# Altium project AVCI_Mk1.PrjPcb (part 2 of 3)

## Sheet NAVC_Peripherals.SchDoc
size A4; SheetNumber: 3; SheetTotal: 8
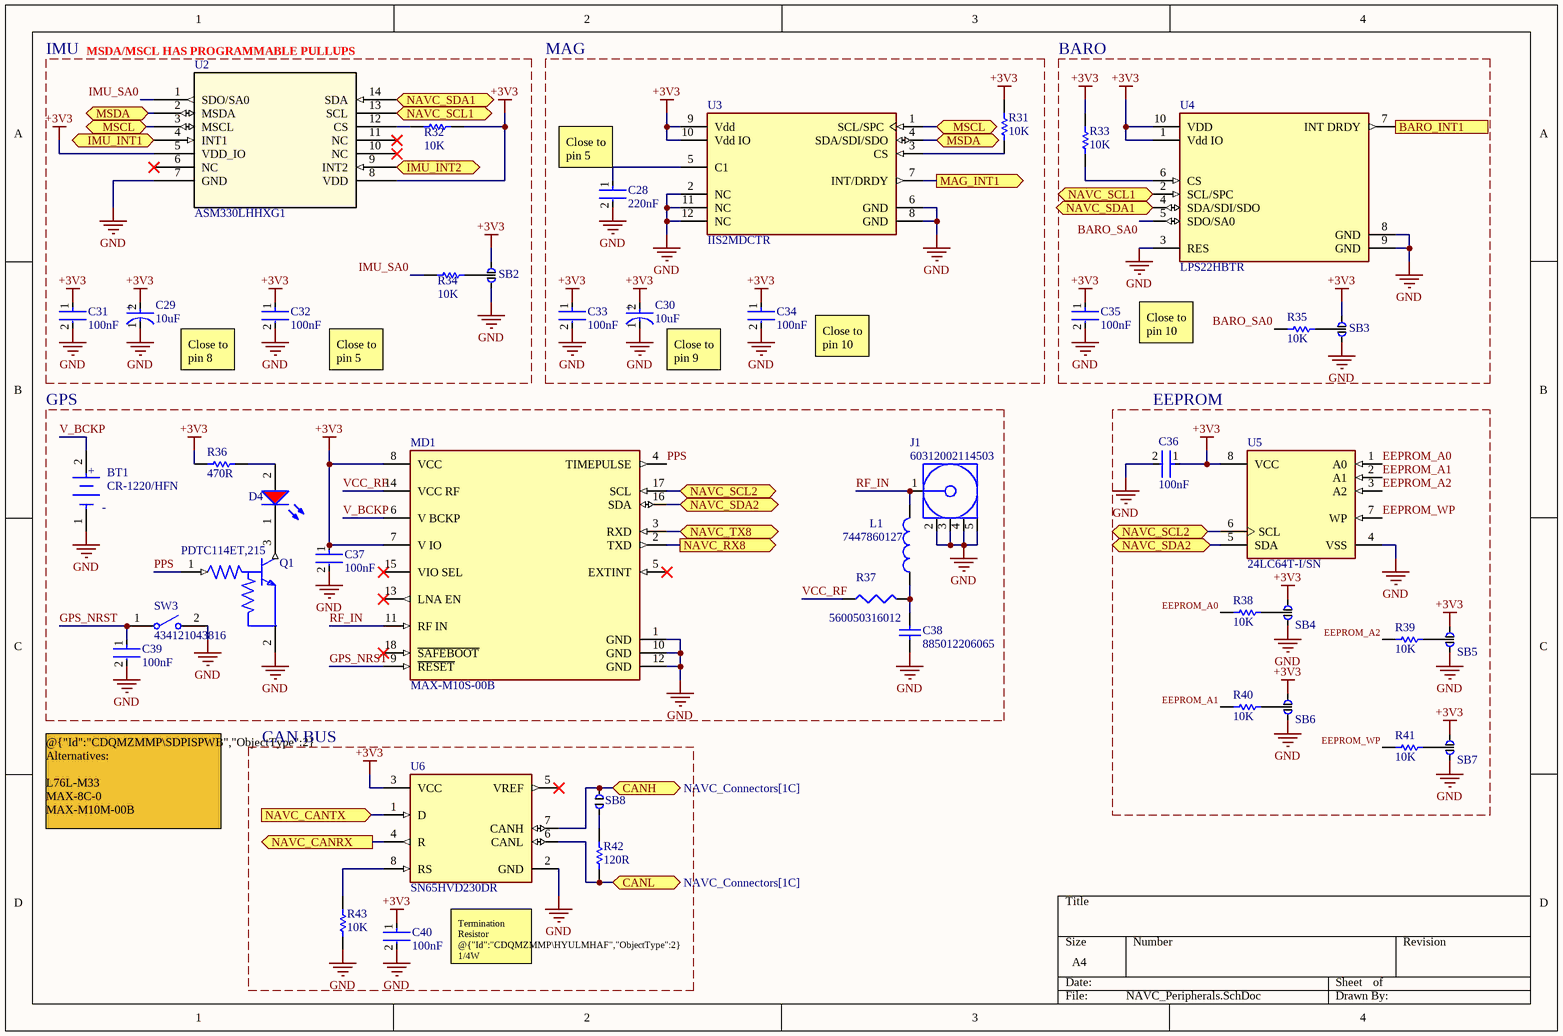
[diagram p4: NAVC_Peripherals.SchDoc]

### Parts
BT1  CR-1220/HFN  [FP-CR-1220-HFN-MFG]
C28  220nF  [FP-C0603C-CF-MFG]
C29  10uF  [FP-T491A106K006AT-MFG]
C30  10uF  [FP-T491A106K006AT-MFG]
C31  100nF  [FP-CGA3E-0_3-0_1-IPC_A]
C32  100nF  [FP-CGA3E-0_3-0_1-IPC_A]
C33  100nF  [FP-CGA3E-0_3-0_1-IPC_A]
C34  100nF  [FP-CGA3E-0_3-0_1-IPC_A]
C35  100nF  [FP-CGA3E-0_3-0_1-IPC_A]
C36  100nF  [FP-CGA3E-0_3-0_1-IPC_A]
C37  100nF  [FP-CGA3E-0_3-0_1-IPC_A]
C38  885012206065  [WCAP-CSGP_0603_L1.6W0.8H0.8_Reflow]
C39  100nF  [FP-CGA3E-0_3-0_1-IPC_A]
C40  100nF  [FP-CGA3E-0_3-0_1-IPC_A]
D4  150120SS75000  [WL-SMCW_1206_150120xx75000]  (value not drawn)
J1  60312002114503  [60312002114503]
L1  7447860127  [WE-MK_0603_L1.6W0.8H0.8]
MD1  MAX-M10S-00B  [FP-MAX-M10S-00B-MFG]
Q1  PDTC114ET,215  [FP-SOT23-MFG]
R31  10K  [RESC1609X50X30NL8T20]
R32  10K  [RESC1609X50X30NL8T20]
R33  10K  [RESC1609X50X30NL8T20]
R34  10K  [RESC1609X50X30NL8T20]
R35  10K  [RESC1609X50X30NL8T20]
R36  470R  [RESC1609X50X30NL8T20]
R37  560050316012  [WRIS-KSKE_0603_L1.6W0.8H0.45]
R38  10K  [RESC1608X55X25ML10T15]
R39  10K  [RESC1608X55X25ML10T15]
R40  10K  [RESC1608X55X25ML10T15]
R41  10K  [RESC1608X55X25ML10T15]
R42  120R  [RESC1608X55X25ML10T15]
R43  10K  [RESC1608X55X25ML10T15]
SB2  Solderbridge3P  [SolderBridge3P]  (value not drawn)
SB3  Solderbridge3P  [SolderBridge3P]  (value not drawn)
SB4  Solderbridge3P  [SolderBridge3P]  (value not drawn)
SB5  Solderbridge3P  [SolderBridge3P]  (value not drawn)
SB6  Solderbridge3P  [SolderBridge3P]  (value not drawn)
SB7  Solderbridge3P  [SolderBridge3P]  (value not drawn)
SB8  SolderbridgeOpen  [SolderBridgeOpen]  (value not drawn)
SW3  434121043816  [434121043816]
U2  ASM330LHHXG1  [LGA-14L_STM]
U3  IIS2MDCTR  [FP-LGA-12-DM00170568-MFG]
U4  LPS22HBTR  [FP-HLGA-10L-8479831-0]
U5  24LC64T-I/SN  [FP-C04-057-SN-MFG]
U6  SN65HVD230DR  [FP-D0008A-IPC_A]

### Blocks framed on the sheet
IMU: C29 C31 C32 R32 R34 SB2 U2
MAG: C28 C30 C33 C34 R31 U3
BARO: C35 R33 R35 SB3 U4
GPS: BT1 C37-C39 D4 J1 L1 MD1 Q1 R36 R37 SW3
EEPROM: C36 R38-R41 SB4-SB7 U5
CAN BUS: C40 R42 R43 SB8 U6

### Ports
BARO_INT1 (out, see NAVC_MCU[2A]), CANH (bidir, see NAVC_Connectors[1C]), CANL (bidir, see NAVC_Connectors[1C]), IMU_INT1 (bidir, see NAVC_MCU[2A]), IMU_INT2 (bidir, see NAVC_MCU[2A]), MAG_INT1 (out, see NAVC_MCU[2A]), MSCL (bidir, see NAVC_Peripherals[1A]), MSCL (bidir, see NAVC_Peripherals[3A]), MSDA (bidir, see NAVC_Peripherals[1A]), MSDA (bidir, see NAVC_Peripherals[3A]), NAVC_CANRX (out, see NAVC_MCU[1A]), NAVC_CANTX (in, see NAVC_MCU[1B]), NAVC_RX8 (out, see NAVC_MCU[1C], NAVC_MCU[2D]), NAVC_SCL1 (bidir, see NAVC_MCU[2A], NAVC_MCU[2D], NAVC_Peripherals[2A]), NAVC_SCL1 (bidir, see NAVC_MCU[2A], NAVC_MCU[2D], NAVC_Peripherals[3A]), NAVC_SCL2 (bidir, see NAVC_MCU[2C], NAVC_MCU[2D], NAVC_Peripherals[2B]), NAVC_SCL2 (bidir, see NAVC_MCU[2C], NAVC_MCU[2D], NAVC_Peripherals[3C]), NAVC_SDA1 (bidir, see NAVC_MCU[2A], NAVC_MCU[2D], NAVC_Peripherals[2A]), NAVC_SDA1 (bidir, see NAVC_MCU[2A], NAVC_MCU[2D], NAVC_Peripherals[3A]), NAVC_SDA2 (bidir, see NAVC_MCU[2C], NAVC_MCU[2D], NAVC_Peripherals[2B]), NAVC_SDA2 (bidir, see NAVC_MCU[2C], NAVC_MCU[2D], NAVC_Peripherals[3C]), NAVC_TX8 (bidir, see NAVC_MCU[1C], NAVC_MCU[2D])

### Nets
+3V3: C29.2(A) C30.2(A) C31.1 C32.1 C33.1 C34.1 C35.1 C36.1 C37.1 C40.1 MD1.7(V_IO) MD1.8(VCC) R31.2 R32.1 R33.2 R36.2 SB2.1 SB3.1 SB4.1 SB5.1 SB6.1 SB7.1 U2.5(VDD_IO) U2.8(VDD) U3.9(Vdd) U3.10(Vdd_IO) U4.1(Vdd_IO) U4.10(VDD) U5.8(VCC) U6.3(VCC)
GND: BT1.1(C) C28.2 C29.1(C) C30.1(C) C31.2 C32.2 C33.2 C34.2 C35.2 C36.2 C37.2 C38.1 C39.2 C40.2 J1.2(GND) J1.3(GND) J1.4(GND) J1.5(GND) MD1.1(GND) MD1.10(GND) MD1.12(GND) Q1.2(GND) R43.2 SB2.2 SB3.2 SB4.2 SB5.2 SB6.2 SB7.2 SW3.2 U2.7(GND) U3.2(NC) U3.6(GND) U3.8(GND) U3.11(NC) U3.12(NC) U4.3(RES) U4.8(GND) U4.9(GND) U5.4(VSS) U6.2(GND)
BARO_SA0: R35.2 U4.5(SDO/SA0)
EEPROM_A0: R38.2 U5.1(A0)
EEPROM_A1: R40.2 U5.2(A1)
EEPROM_A2: R39.2 U5.3(A2)
EEPROM_WP: R41.2 U5.7(WP)
GPS_NRST: C39.1 MD1.9(~{RESET}) SW3.1
IMU_SA0: R34.2 U2.1(SDO/SA0)
PPS: MD1.4(TIMEPULSE) Q1.1(I)
RF_IN: J1.1(Signal) L1.2 MD1.11(RF_IN)
V_BCKP: BT1.2(A) MD1.6(V_BCKP)
VCC_RF: MD1.14(VCC_RF) R37.1
NetC28_1: C28.1 U3.5(C1)
NetC38_2: C38.2 L1.1 R37.2
NetD4_1: D4.1(K) Q1.3(O)
NetD4_2: D4.2(A) R36.1
NetMD1_2: MD1.2(TXD) ; port NAVC_RX8
NetMD1_3: MD1.3(RXD) ; port NAVC_TX8
NetMD1_16: MD1.16(SDA) U5.5(SDA) ; port NAVC_SDA2
NetMD1_17: MD1.17(SCL) U5.6(SCL) ; port NAVC_SCL2
NetP6_2: R42.2 U6.6(CANL) ; port CANL
NetP6_3: SB8.2 U6.7(CANH) ; port CANH
NetR1_5: U3.7(INT/DRDY) ; port MAG_INT1
NetR1_6: U2.4(INT1) ; port IMU_INT1
NetR1_7: U2.9(INT2) ; port IMU_INT2
NetR1_8: U4.7(INT_DRDY) ; port BARO_INT1
NetR9_1: U6.4(R) ; port NAVC_CANRX
NetR10_1: U6.1(D) ; port NAVC_CANTX
NetR24_1: U2.13(SCL) U4.2(SCL/SPC) ; port NAVC_SCL1
NetR25_1: U2.14(SDA) U4.4(SDA/SDI/SDO) ; port NAVC_SDA1
NetR31_1: R31.1 U3.3(CS)
NetR32_2: R32.2 U2.12(CS)
NetR33_1: R33.1 U4.6(CS)
NetR34_1: R34.1 SB2.3
NetR35_1: R35.1 SB3.3
NetR38_1: R38.1 SB4.3
NetR39_1: R39.1 SB5.3
NetR40_1: R40.1 SB6.3
NetR41_1: R41.1 SB7.3
NetR42_1: R42.1 SB8.1
NetR43_1: R43.1 U6.8(RS)
NetU2_2: U2.2(MSDA) U3.4(SDA/SDI/SDO) ; port MSDA
NetU2_3: U2.3(MSCL) U3.1(SCL/SPC) ; port MSCL

Not connected (* = marked no-connect by the designer): MD1 5(EXTINT)* 13(LNA_EN)* 15(VIO_SEL)* 18(~{SAFEBOOT})*; U2 6(NC)* 10(NC)* 11(NC)*; U6 5(VREF)*

### Notes on the sheet
- (near U2) MSDA/MSCL HAS PROGRAMMABLE PULLUPS
- (near C28) Close to pin 5
- Close to pin 8
- Close to pin 5
- Close to pin 9
- Close to pin 10
- @{"Id":"CDQMZMMP\SDPISPWB","ObjectType":2} Alternatives:
  L76L-M33
  MAX-8C-0
  MAX-M10M-00B
- Termination Resistor @{"Id":"CDQMZMMP\HYULMHAF","ObjectType":2} 1/4W
- (in symbol CMP-03017-000032-1) +
- (in symbol CMP-05417-000010-1) +; -

### Library data of the parts
BT1 = CMP-05417-000010-1: BATTERY LITHIUM 3V COIN 12.5MM; Manufacturer: Panasonic; Standoff Height: 2.9mm; Temperature Range High: +60°C; Temperature: -30°C to +60°C; Device Class L2: unset; Height: 5.5mm; Category: Batt; Device Class L3: unset; Package: CR-1220/HFN; ComponentLink2URL: https://industrial.panasonic.com/cdbs/www-data/pdf2/AAA4000/AAA4000D138.PDF; ComponentLink2Description: Datasheet; Temperature Range Low: -30°C; Mouser Description: CR1220 Series Ø 12.5 mm 3 V 35 mAh Non-Rechargeable Lithium Coin Cell Battery; Octopart: https://octopart.com/cr-1220%2Fhfn-panasonic-13183313; Manufacturer Part Number: CR-1220/HFN; Automotive: No; Digikey Description: BATTERY LITHIUM 3V COIN 12.5MM; Device Class L1: Passive Components
C28 = CMP-2006-03146-2: CAP CER 0.22UF 25V 10% X7R 0603; Manufacturer: KEMET; Manufacturer Part Number: C0603C224K3RACTU; Temperature Coefficient: 30ppm/°C; Value: 0.22 μF; Material: Ceramic; Tolerance: 0.1; Automotive Grade: Grade 1; Device Class L2: Capacitors; Automotive: Yes; RoHS: TRUE; Digikey Description: CAP CER 0.22UF 25V 10% X7R 0603; Package: C0603C-CF; Height: 0.87mm; Temperature Characteristic: X7R; Mouser Description: Multilayer Ceramic Capacitors MLCC - SMD/SMT 25volts 0.22uF X7R 10%; Device Class L3: Ceramic Capacitors; Lead Free: Yes; Capacitance: 0.22 μF; Device Class L1: Passive Components; ComponentLink2Description: Datasheet; Temperature: -55°C to +125°C; Voltage Rating: 25 V; Temperature Range Low: -55°C; ComponentLink2URL: https://api.kemet.com/component-edge/download/datasheet/C0603C100J5GACAUTO.pdf; Octopart: https://octopart.com/c0603c224k3ractu-kemet-129141; Temperature Range High: +125°C; Category: Cap
C29 C30 = CMP-03017-000032-1: CAP TANT 10UF 10% 6.3V 1206; Life (Hours): 2000Hour; Polarity: Polar; Dielectric Material: Tantalum; Leakage Current: 600nA; Dissipation Factor: 6%; ESR (Equivalent Series Resistance): 4R; Lead Free: Lead Free; Features: General Purpose; Length: 3.2mm; Mount: Surface Mount; Number of Pins: 2; RoHS Compliant: Yes; Case/Package: 1206; Width: 1.6mm; Capacitance: 10uF; REACH SVHC: No SVHC; Voltage Rating (DC): 6.3V; Max Operating Temperature: 125°C; Height - Seated (Max): 0.071inch; Termination: SMD/SMT; Radiation Hardening: No; Tolerance: 10%; Min Operating Temperature: -55°C; Lead Pitch: 1.2mm; Voltage: 6.3V; Depth: 1.6mm; Case Code (Imperial): 1206; Case Code (Metric): 3216; Packaging: Tape and Reel; Height: 1.6mm; Voltage Rating: 6.3V; Package Quantity: 1
C31-C37 C39 C40 = CMP-2000-07546-2: Cap Ceramic 100nF 50V X7R 10% Pad SMD 0603 +125°C Automotive T/R; Weight: 7.1E-05oz; Composition: Ceramic; Max Operating Temperature: 125°C; Termination: SMD/SMT; Dielectric: X7R; Length: 1.6mm; Package Quantity: 1; REACH SVHC: No SVHC; Lead Free: Lead Free; Case Code (Metric): 1608; Min Operating Temperature: -55°C; Packaging: Tape and Reel; Tolerance: 10%; Voltage Rating: 50V; Case Code (Imperial): 0603; Capacitance: 100nF; Case/Package: 0603; Voltage Rating (DC): 50V; Depth: 0.8mm; Radiation Hardening: No; Ratings: AEC-Q200; Mount: Surface Mount; Voltage: 50V; Thickness: 0.035inch; Width: 0.8mm; Height: 0.8mm
C38 = CMP-03913-53914774-1: 885012206065 Cap Cer 10000PF 25V X7R 0603; Insulation Resistance: 10GΩ; Tolerance: 10%; Capacitance: 10nF; REACH SVHC: Unknown; Height: 800µm; NexarPartId: 53914774; Case Code (Metric): 1608; Voltage Rating: 25V; Case Code (Imperial): 0603; Width: 800µm; Max Operating Temperature: 125°C; Min Operating Temperature: -55°C; Mount: Surface Mount; Voltage Rating (DC): 25V; Length: 1.6mm; Dielectric: X7R; Case/Package: 0603; Packaging: Tape & Reel (TR); RoHS: Compliant; Thickness: 939.8µm
D4 = CMP-1426-00017-3: Led, Red, 630 Nm, 1.9 V, 30 Ma, 60 Mcd Rohs Compliant: Yes; Forward Current: 100mA; Max Reverse Voltage (DC): 5V; Lens Style: Clear, Rectangular; Viewing Angle: 140°; Luminous Intensity: 60mcd; Peak Wavelength: 645nm; Forward Voltage: 1.9V; Test Current: 20mA; Dominant Wavelength: 630nm; Case Code (Imperial): 1206; Length: 3.2mm; Mount: Surface Mount; Case Code (Metric): 3216; Case/Package: 1206; Min Operating Temperature: -40°C; Width: 1.6mm; Color: Red; Height: 680µm; REACH SVHC: Unknown; Max Operating Temperature: 85°C; Wavelength: 630nm; RoHS: Compliant; Packaging: Tape and Reel
J1 = CMP-207975-000002-2: SMA PCB THT JACK STRAIGHT WR-SMA; NexarPartId: 97004423; Insertion Loss (dB): 0.14dB; Number of Contacts: 1; Voltage Rating: 335V; Impedance: 50Ω; Frequency: 18GHz; Dielectric Material: PTFE; Insulation Resistance: 5GΩ; Orientation: Straight; Contact Material: Gold, Nickel; Min Operating Temperature: -65°C; Insulation Material: PTFE; Connector Type: SMA; Max Operating Temperature: 165°C; Height: 9.76mm
L1 = CMP-03913-110288215-1: 7447860127 Inductor, Multilayer, 27Nh, 0.3A, 0603 Rohs Compliant: Yes; Current Rating: 500mA; Min Operating Temperature: -55°C; NexarPartId: 110288215; Height: 800µm; Inductance: 27nH; Length: 1.6mm; RoHS: Compliant; Width: 800µm; Ambient Temperature Range Low: -55°C; Ambient Temperature Range High: 105°C; Max Operating Temperature: 125°C
MD1 = CMP-207130-000026-1: GNSS LCC RX, ROM, TCXO, LNA, SAW
Q1 = CMP-11424-78740999-1: PDTC114ET,215 Transistor NPN - Pre-Biased, SOT-23 (TO-236AB) 50V 100mA250mW Surface Mount; Manufacturer Lifecycle Status: RELEASED FOR SUPPLY; Power Dissipation: 250mW; hFE Min: 30; Collector Emitter Saturation Voltage: 150mV; Max Junction Temperature (Tj): 150°C; Number of Elements: 1; Max Collector Current: 100mA; Emitter Base Voltage (VEBO): 10V; Height: 1.1mm; Number of Pins: 3; Lifecycle Status: Production; Ambient Temperature Range High: 150°C; RoHS: Non-Compliant; Polarity: NPN; Collector Base Voltage (VCBO): 50V; Collector Emitter Voltage (VCEO): 50V; NexarPartId: 78740999; Schedule B: 8541210080, 8541210080; Packaging: Digi-Reel®
R31-R36 = CMP-2000-03816-5: Chip Resistor, 0 Ohm, Jumper, 100 mW, -55 to 155 degC, 0603 (1608 Metric), RoHS, Tape and Reel; Manufacturer: Vishay Semiconductor; Voltage Rating: 75 V; Package Quantity: 5000; DatasheetVersion: 06/2012; Min Operating Temperature: -55 degC; ComponentLink1URL: http://www.vishay.com/; Mounting Technology: Surface Mount; Height: 0.45 mm; ComponentLink1Description: Manufacturer URL; REACH SVHC: Unknown; PackageReference: 0603; Packaging: Tape and Reel; Max Operating Temperature: 155 degC; Mount: Surface Mount; ComponentLink2Description: Datasheet; PackageDescription: 2-Pin Surface Mount Device, Body 1.575 x 0.85 mm; Length: 1.55 mm; ComponentLink2URL: http://www.vishay.com/docs/20035/dcrcwe3.pdf; Pins: 2; RoHSCompliant: true
R37 = CMP-207829-000001-2: WRIS-KSKE Thick Film Resistors; NexarPartId: 107086665; Current Rating: 150mA; Voltage Rating: 1.5811V; Tolerance: 1%; Resistance: 10Ω; Power Rating: 250mW; Temperature Coefficient: 100ppm/°C; Composition: Thick Film; Length: 1.6mm; RoHS: Compliant; Height: 450µm; Max Operating Temperature: 155°C; Min Operating Temperature: -55°C; Width: 800µm; Case/Package: 0603
R38-R43 = CMP-2100-03667-1: Chip Resistor, 0 Ohm, +/- 5%, 0.1 W, -55 to 155 degC, 0603 (1608 Metric), RoHS, Tape and Reel; Manufacturer: Yageo; Temperature Coefficient: 200ppm/degreesC; Voltage Rating: 50V; Power Rating: 100mW; Resistance: 0mOhm; Width: 0.8mm; Max Operating Temperature: 155degC; Tolerance: 5%; Package Reference: 0603; Height: 0.45mm; Depth: 0.8mm; Package Description: 2-Pin Surface Mount Device, Body 1.6 x 0.8 mm; Termination: SMD/SMT; Package Quantity: 5000; Case/Package: 0603; Case Code (Imperial): 0603; Radiation Hardening: No; Number of Pins: 2; Length: 1.6mm; Lead Free: LeadFree; Voltage Rating (DC): 50V; Military Standard: Not; Datasheet URL: http://www.yageo.com/NewPortal/yageodocoutput?fileName=/pdf/R-Chip/PYu-RC_Group_51_RoHS_L_5.pdf; Manufacturer URL: http://www.yageo.com/; Packaging: TapeandReel; Case Code (Metric): 1608; Min Operating Temperature: -55degC; Composition: ThickFilm; RoHSCompliant: true; Contact Plating: Tin; Datasheet Version: Rev. 5, 10/2016; REACH SVHC: NoSVHC
SW3 = CMP-1459-00005-3: Switch Tactile Spst-no 0.05A 12V; Contact Resistance: 100mΩ; Current Rating: 50mA; Operating Force: 160N; Packaging: Tape and Reel; Width: 6mm; Voltage Rating: 12V; Min Operating Temperature: -40°C; RoHS: Compliant; Height: 4.3mm; Insulation Resistance: 100MΩ; Contact Plating: Silver; Contact Current Rating: 50mA; Max Operating Temperature: 85°C
U2 = ASM330LHHXG1: No Description Available; Mfr_Name: STMicroelectronics; Type: Motion Sensors; RefDes: RefDes
U3 = CMP-12173-000003-1: SENSOR MR I2C/SPI 12LGA; Axis: X, Y, Z; Output Type: SPI; Sensing Method: Magnetoresistive; Resolution: 16b; Case/Package: LGA; Min Operating Temperature: -40°C; Packaging: Cut Tape; Number of Pins: 12; Max Operating Temperature: 85°C; RoHS Compliant: Yes
U4 = CMP-12182-000004-1: MEMS NANO PRESSURE SENSOR: 260-1; Manufacturer: STMicroelectronics; Sensor Output: I2C,SPI; Port Style: No Port; Max Supply Voltage: 3.6V; Operating Supply Current: 3-12uA; Min Supply Voltage: 1.7V; Device Class L3: unset; Device Class L1: Sensors; Manufacturer Part Number: LPS22HBTR; Temperature Range High: +85°C; Digikey Description: MEMS NANO PRESSURE SENSOR: 260-1; Device Class L2: Pressure Sensors; RoHS: TRUE; Lead Free: Yes; Height: 0.8mm; Automotive: No; Octopart: https://octopart.com/lps22hbtr-stmicroelectronics-51851131; Package: HLGA-10L-8479831; Temperature Range Low: -40°C; Category: IC; Temperature: -40°C to +85°C; ComponentLink2Description: Datasheet; ComponentLink2URL: https://www.st.com/resource/en/datasheet/lps22hb.pdf; Footprint Url: https://www.st.com/content/ccc/resource/technical/document/technical_note/73/17/9c/16/dd/96/4a/01/CD00134799.pdf/files/CD00134799.pdf/jcr:content/translations/en.CD00134799.pdf
U5 = CMP-0159-00199-2: IC EEPROM 64K I2C 400KHZ 8SOIC; Manufacturer: Microchip Technology; Min Supply Voltage: 2.5V; Interface: I2C,2-Wire; Access Time: 900ns; Memory Size: 64Kbits; Max Supply Voltage: 5.5V; Nominal Supply Current: 0.05-100uA; Standoff Height: 0.1mm; Temperature: -40°C to +85°C; Automotive: No; Ambient Temperature Range Low: -40°C; Device Class L1: Integrated Circuits (ICs); Footprint 1 Description: SOIC, 8-Leads, Body 4.9x3.8mm, Pitch 1.27mm, IPC High Density; Octopart: https://octopart.com/24lc64t-i%2Fsn-microchip-451854; Footprint Url: http://ww1.microchip.com/downloads/en/DeviceDoc/08L_SOIC_150_3dot9mm_SN_C04-00057e.pdf; Footprint 0 Description: SOIC, 8-Leads, Body 4.9x3.8mm, Pitch 1.27mm, IPC Medium Density; Memory Type: EEPROM; ComponentLink2Description: Datasheet; Digikey Description: IC EEPROM 64K I2C 400KHZ 8SOIC; Manufacturer Part Number: 24LC64T-I/SN; Temperature Range Low: -40°C; Footprint 2 Description: SOIC, 8-Leads, Body 4.9x3.8mm, Pitch 1.27mm, IPC Low Density; ComponentLink2URL: http://ww1.microchip.com/downloads/en/DeviceDoc/21189T.pdf; RoHS: TRUE; Device Class L2: Memory; Ambient Temperature Range High: +85°C; Mouser Description: EEPROM 8kx8 - 2.5V; Lead Free: Yes; Temperature Range High: +85°C; Frequency: 400kHz; Height: 1.75mm; Package: C04-057-SN; Ipc Land Pattern Name: SOIC127P600X175-8; Category: IC; Device Class L3: EEPROM
U6 = CMP-0315-00015-3: IC TRANSCEIVER HALF 1/1 8SOIC; Number of Transceivers: 1; Operating Supply Voltage: 3.3V; Number of I/Os: 2; Max Supply Current: 17mA; Max Supply Voltage: 3.6V; Min Supply Voltage: 3V; Data Rate: 1Mbps; Min Operating Temperature: -40°C; Packaging: Tape and Reel; Lead Free: Lead Free; Number of Transmit Buffers: 1; Max Operating Temperature: 85°C; Number of Receive Buffers: 1; Number of Pins: 8; Package Quantity: 1; Radiation Hardening: No; Case/Package: D; REACH SVHC: No SVHC; Weight: 0.002561oz; Termination: SMD/SMT; Contact Plating: Gold; Nominal Supply Current: 17mA; Number of Receivers: 1; Number of Drivers: 1

## Sheet NAVC_Connectors.SchDoc
size A4; SheetNumber: 4; SheetTotal: 8
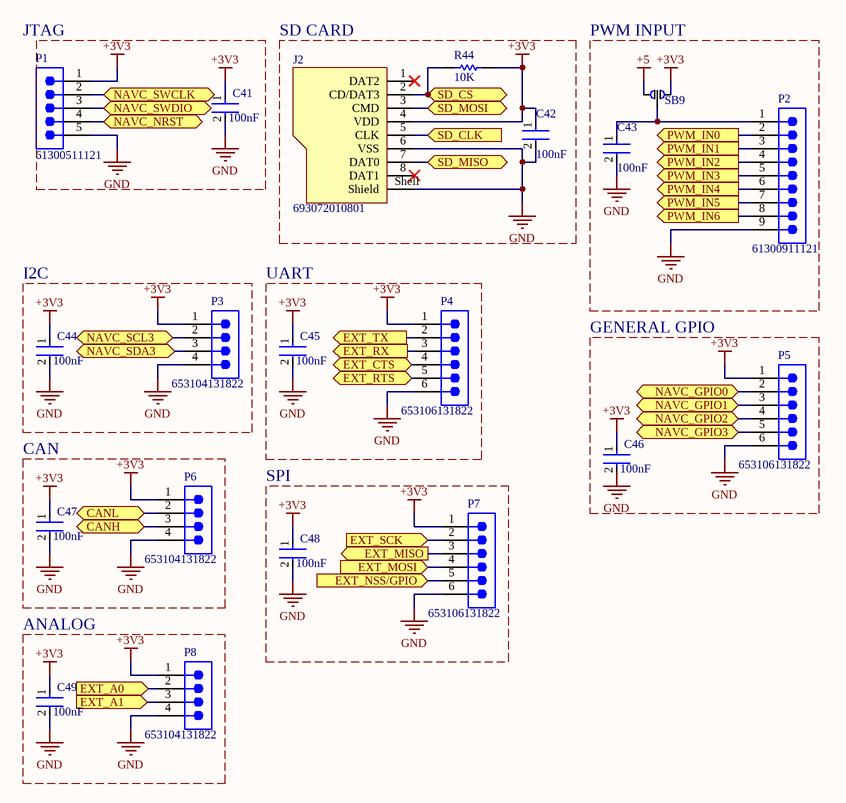
[diagram p5: NAVC_Connectors.SchDoc]

### Parts
C41  100nF  [FP-CGA3E-0_3-0_1-IPC_A]
C42  100nF  [FP-CGA3E-0_3-0_1-IPC_A]
C43  100nF  [FP-CGA3E-0_3-0_1-IPC_A]
C44  100nF  [FP-CGA3E-0_3-0_1-IPC_A]
C45  100nF  [FP-CGA3E-0_3-0_1-IPC_A]
C46  100nF  [FP-CGA3E-0_3-0_1-IPC_A]
C47  100nF  [FP-CGA3E-0_3-0_1-IPC_A]
C48  100nF  [FP-CGA3E-0_3-0_1-IPC_A]
C49  100nF  [FP-CGA3E-0_3-0_1-IPC_A]
J2  693072010801  [693072010801]
P1  61300511121  [61300511121]
P2  61300911121  [61300911121]
P3  653104131822  [653104131822]
P4  653106131822  [653106131822]
P5  653106131822  [653106131822]
P6  653104131822  [653104131822]
P7  653106131822  [653106131822]
P8  653104131822  [653104131822]
R44  10K  [RESC1608X55X25ML10T15]
SB9  Solderbridge3P  [SolderBridge3P]  (value not drawn)

### Blocks framed on the sheet
SD CARD: C42 J2 R44
PWM INPUT: C43 P2 SB9
I2C: C44 P3
UART: C45 P4
GENERAL GPIO: C46 P5
CAN: C47 P6
SPI: C48 P7
ANALOG: C49 P8

### Ports
CANH (bidir, see NAVC_Peripherals[2D]), CANL (bidir, see NAVC_Peripherals[2D]), EXT_A0 (in, see NAVC_MCU[1A]), EXT_A1 (in, see NAVC_MCU[1A]), EXT_CTS (bidir, see NAVC_MCU[2B], NAVC_MCU[2D]), EXT_MISO (out, see NAVC_MCU[1C]), EXT_MOSI (in, see NAVC_MCU[1D]), EXT_NSS/GPIO (in, see NAVC_MCU[1C]), EXT_RTS (bidir, see NAVC_MCU[2B]), EXT_RX (out, see NAVC_MCU[2A], NAVC_MCU[2D]), EXT_SCK (in, see NAVC_MCU[1C]), EXT_TX (out, see NAVC_MCU[2A], NAVC_MCU[2D]), NAVC_GPIO0 (bidir, see NAVC_MCU[2B]), NAVC_GPIO1 (bidir, see NAVC_MCU[2B]), NAVC_GPIO2 (bidir, see NAVC_MCU[2B]), NAVC_GPIO3 (bidir, see NAVC_MCU[2B]), NAVC_NRST (bidir, see NAVC_MCU[3B], NAVC_MCU[3C]), NAVC_SCL3 (bidir, see NAVC_MCU[2D], NAVC_MCU[3A]), NAVC_SDA3 (bidir, see NAVC_MCU[2D], NAVC_MCU[3A]), NAVC_SWCLK (bidir, see NAVC_MCU[1B]), NAVC_SWDIO (bidir, see NAVC_MCU[1B]), PWM_IN0 (out, see NAVC_MCU[1A]), PWM_IN1 (out, see NAVC_MCU[1A]), PWM_IN2 (out, see NAVC_MCU[1A]), PWM_IN3 (out, see NAVC_MCU[1B]), PWM_IN4 (out, see NAVC_MCU[1B]), PWM_IN5 (out, see NAVC_MCU[1B]), PWM_IN6 (out, see NAVC_MCU[1B]), SD_CLK (in, see NAVC_MCU[1A]), SD_CS (bidir, see NAVC_MCU[1A]), SD_MISO (bidir, see NAVC_MCU[1A]), SD_MOSI (bidir, see NAVC_MCU[1A])

### Nets
+3V3: C41.1 C42.1 C44.1 C45.1 C46.1 C47.1 C48.1 C49.1 J2.4(VDD) P1.1 P3.1 P4.1 P5.1 P6.1 P7.1 P8.1 R44.2 SB9.2
+5: SB9.1
GND: C41.2 C42.2 C43.2 C44.2 C45.2 C46.2 C47.2 C48.2 C49.2 J2.6(VSS) J2.Shell(Shield) P1.5 P2.9 P3.4 P4.6 P5.6 P6.4 P7.6 P8.4
NetC5_1: P1.4 ; port NAVC_NRST
NetC43_1: C43.1 P2.1 SB9.3
NetJ2_2: J2.2(CD/DAT3) R44.1 ; port SD_CS
NetJ2_3: J2.3(CMD) ; port SD_MOSI
NetJ2_5: J2.5(CLK) ; port SD_CLK
NetJ2_7: J2.7(DAT0) ; port SD_MISO
NetP1_2: P1.2 ; port NAVC_SWCLK
NetP1_3: P1.3 ; port NAVC_SWDIO
NetP2_2: P2.2 ; port PWM_IN0
NetP2_3: P2.3 ; port PWM_IN1
NetP2_4: P2.4 ; port PWM_IN2
NetP2_5: P2.5 ; port PWM_IN3
NetP2_6: P2.6 ; port PWM_IN4
NetP2_7: P2.7 ; port PWM_IN5
NetP2_8: P2.8 ; port PWM_IN6
NetP3_2: P3.2 ; port NAVC_SCL3
NetP3_3: P3.3 ; port NAVC_SDA3
NetP4_2: P4.2 ; port EXT_TX
NetP4_3: P4.3 ; port EXT_RX
NetP4_4: P4.4 ; port EXT_CTS
NetP4_5: P4.5 ; port EXT_RTS
NetP5_2: P5.2 ; port NAVC_GPIO0
NetP5_3: P5.3 ; port NAVC_GPIO1
NetP5_4: P5.4 ; port NAVC_GPIO2
NetP5_5: P5.5 ; port NAVC_GPIO3
NetP6_2: P6.2 ; port CANL
NetP6_3: P6.3 ; port CANH
NetP7_2: P7.2 ; port EXT_SCK
NetP7_3: P7.3 ; port EXT_MISO
NetP7_4: P7.4 ; port EXT_MOSI
NetP7_5: P7.5 ; port EXT_NSS/GPIO
NetP8_2: P8.2 ; port EXT_A0
NetP8_3: P8.3 ; port EXT_A1

Not connected (* = marked no-connect by the designer): J2 1(DAT2)* 8(DAT1)*

### Notes on the sheet
- (near P1) JTAG

### Library data of the parts
C41-C49 = CMP-2000-07546-2: as C31 on sheet NAVC_Peripherals; Weight: 7.1E-05oz; Composition: Ceramic; Max Operating Temperature: 125°C; Termination: SMD/SMT; Dielectric: X7R; Length: 1.6mm; Package Quantity: 1; REACH SVHC: No SVHC; Lead Free: Lead Free; Case Code (Metric): 1608; Min Operating Temperature: -55°C; Packaging: Tape and Reel; Tolerance: 10%; Voltage Rating: 50V; Case Code (Imperial): 0603; Capacitance: 100nF; Case/Package: 0603; Voltage Rating (DC): 50V; Depth: 0.8mm; Radiation Hardening: No; Ratings: AEC-Q200; Mount: Surface Mount; Voltage: 50V; Thickness: 0.035inch; Width: 0.8mm; Height: 0.8mm
J2 = CMP-1502-00164-2: NexarPartId: 22866686; Voltage Rating: 100V; Insulation Resistance: 1GΩ; Current Rating: 500mA; Memory Type: FLASH; Number of Positions: 8; Connector Type: Connector; Width: 13.5mm; Number of Pins: 8; REACH SVHC: Unknown; Contact Material: Copper, Gold; Contact Plating: Gold; Max Operating Temperature: 85°C; Color: Black; Operating Supply Voltage: 100V; Packaging: Tape and Reel; RoHS: Compliant; Height: 1.75mm; Number of Contacts: 8; Mount: Surface Mount; Length: 14.5mm; Min Operating Temperature: -25°C
P1 = CMP-1502-01068-3: NexarPartId: 32855526; Connector Type: Male Pin; Gender: Male; Contact Resistance: 20mΩ; Pitch: 2.54mm; Operating Supply Voltage: 250V; Current Rating: 3A; Number of Contacts: 5; Lead Free: Lead Free; Color: Black; Packaging: Bulk; Lead Pitch: 2.54mm; Contact Material: Copper; Min Operating Temperature: -40°C; Contact Mating Length: 5.9944mm; Voltage Rating: 250V; Number of Pins: 5; Number of Positions: 5; Height: 8.89mm; Orientation: Vertical; REACH SVHC: Unknown; RoHS: Compliant; Contact Plating: Gold; Max Operating Temperature: 105°C; Mount: Through Hole; Number of Rows: 1; Termination: Solder
P2 = CMP-1502-01080-3: NexarPartId: 32855536; Current Rating: 3A; Connector Type: Male Pin; Operating Supply Voltage: 250V; Contact Resistance: 20mΩ; Pitch: 2.54mm; Number of Contacts: 9; Gender: Male; Lead Pitch: 2.54mm; REACH SVHC: Unknown; Number of Rows: 1; Mount: Through Hole; Contact Plating: Gold; Color: Black; Number of Pins: 9; Orientation: Vertical; Contact Material: Copper; Packaging: Bulk; Contact Mating Length: 5.9944mm; RoHS: Compliant; Number of Positions: 9; Termination: Solder
P3 P6 P8 = CMP-1502-00773-2: NexarPartId: 18818278; Contact Resistance: 20mΩ; Insulation: Insulated; Current Rating: 1A; Number of Positions: 4; Gender: Male; Insulation Resistance: 100MΩ; Pitch: 1.25mm; Operating Supply Voltage: 125V; Connector Type: Male Pin; Housing Material: Nylon; RoHS: Compliant; Number of Pins: 4; Flammability Rating: UL94 V-0; Termination: SMD/SMT; Contact Mating Length: 2.1336mm; Contact Gender: Male; Min Operating Temperature: -40°C; Packaging: Tape and Reel; Number of Contacts: 4; Color: Beige, White; Contact Plating: Tin; Max Operating Temperature: 85°C; Voltage Rating: 125V; Mount: Surface Mount; Lead Pitch: 1.25mm; Length: 9.75mm; Number of Rows: 1; Height: 4.2mm; Contact Material: Copper; Width: 9.75mm; REACH SVHC: Unknown
P4 P5 P7 = CMP-1502-00775-2: NexarPartId: 116856464; Insulation Resistance: 100MΩ; Current Rating: 1A; Gender: Male; Pitch: 1.25mm; Min Operating Temperature: -40°C; Packaging: Tape and Reel; Length: 12.25mm; Contact Plating: Tin; Max Operating Temperature: 85°C; Number of Pins: 6; RoHS: Compliant
R44 = CMP-2100-03667-1: as R38 on sheet NAVC_Peripherals; Width: 0.8mm; Max Operating Temperature: 155degC; Tolerance: 5%; Package Reference: 0603; Height: 0.45mm; Depth: 0.8mm; Package Description: 2-Pin Surface Mount Device, Body 1.6 x 0.8 mm; Termination: SMD/SMT; Package Quantity: 5000; Case/Package: 0603; Case Code (Imperial): 0603; Radiation Hardening: No; Number of Pins: 2; Length: 1.6mm; Lead Free: LeadFree; Voltage Rating (DC): 50V; Military Standard: Not; Datasheet URL: http://www.yageo.com/NewPortal/yageodocoutput?fileName=/pdf/R-Chip/PYu-RC_Group_51_RoHS_L_5.pdf; Manufacturer URL: http://www.yageo.com/; Packaging: TapeandReel; Case Code (Metric): 1608; Min Operating Temperature: -55degC; Composition: ThickFilm; RoHSCompliant: true; Contact Plating: Tin; Datasheet Version: Rev. 5, 10/2016; REACH SVHC: NoSVHC

## Sheet FCC_MCU.SchDoc
size A4; SheetNumber: 5; SheetTotal: 8
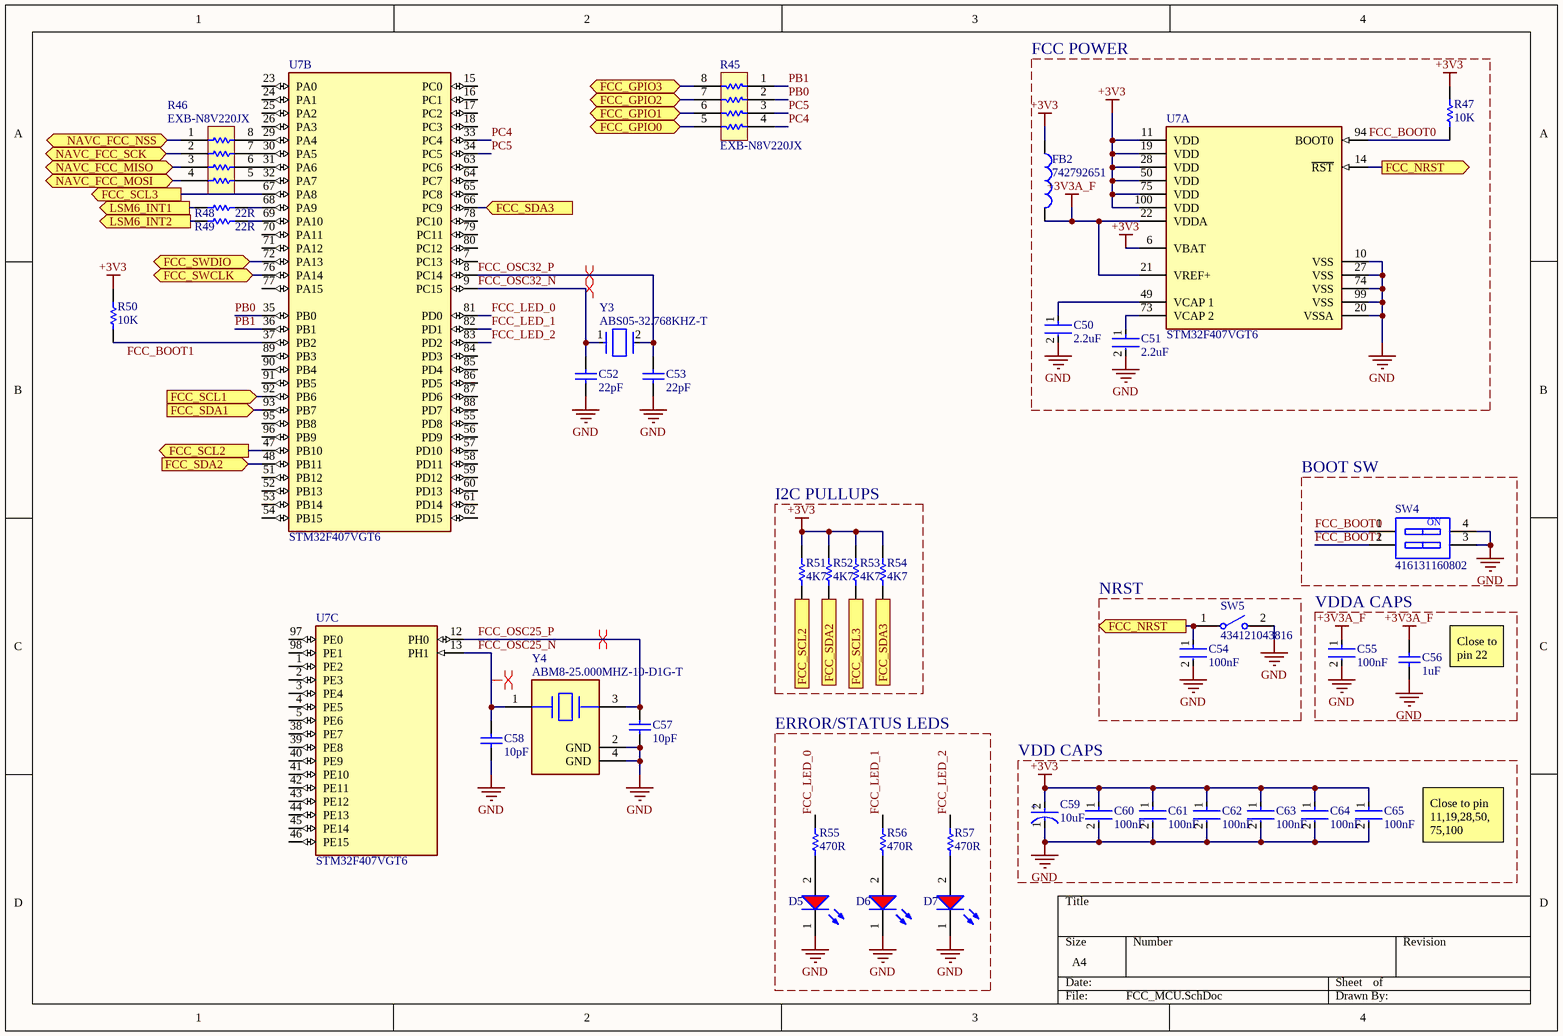
[diagram p6: FCC_MCU.SchDoc]

### Parts
C50  2.2uF  [FP-CGA3E-0_3-0_1-IPC_A]
C51  2.2uF  [FP-CGA3E-0_3-0_1-IPC_A]
C52  22pF  [CAPC1608X90X35ML10T15]
C53  22pF  [CAPC1608X90X35ML10T15]
C54  100nF  [FP-CGA3E-0_3-0_1-IPC_A]
C55  100nF  [FP-CGA3E-0_3-0_1-IPC_A]
C56  1uF  [CAPC1608X87X35LL15T15]
C57  10pF  [CAPC1608X90X35LL10T15]
C58  10pF  [CAPC1608X90X35LL10T15]
C59  10uF  [FP-T491A106K006AT-MFG]
C60  100nF  [FP-CGA3E-0_3-0_1-IPC_A]
C61  100nF  [FP-CGA3E-0_3-0_1-IPC_A]
C62  100nF  [FP-CGA3E-0_3-0_1-IPC_A]
C63  100nF  [FP-CGA3E-0_3-0_1-IPC_A]
C64  100nF  [FP-CGA3E-0_3-0_1-IPC_A]
C65  100nF  [FP-CGA3E-0_3-0_1-IPC_A]
D5  150120SS75000  [WL-SMCW_1206_150120xx75000]  (value not drawn)
D6  150120SS75000  [WL-SMCW_1206_150120xx75000]  (value not drawn)
D7  150120SS75000  [WL-SMCW_1206_150120xx75000]  (value not drawn)
FB2  742792651  [WE-CBF_0603_L1.6W0.8H0.8_HC]
R45  EXB-N8V220JX  [BOUR-CAT10_V]
R46  EXB-N8V220JX  [BOUR-CAT10_V]
R47  10K  [RESC1608X55X25ML10T15]
R48  22R  [RESC1608X55X25ML10T15]
R49  22R  [RESC1608X55X25ML10T15]
R50  10K  [RESC1608X55X25ML10T15]
R51  4K7  [RESC1608X55X25ML10T15]
R52  4K7  [RESC1608X55X25ML10T15]
R53  4K7  [RESC1608X55X25ML10T15]
R54  4K7  [RESC1608X55X25ML10T15]
R55  470R  [RESC1609X50X30NL8T20]
R56  470R  [RESC1609X50X30NL8T20]
R57  470R  [RESC1609X50X30NL8T20]
SW4  416131160802  [416131160802]
SW5  434121043816  [434121043816]
U7  STM32F407VGT6  [FP-LQFP100-1L-MFG]  (parts A,B,C of 3)
Y3  ABS05-32.768KHZ-T  [FP-ABS05-MFG]
Y4  ABM8-25.000MHZ-10-D1G-T  [FP-ABM8-MFG]

### Blocks framed on the sheet
FCC POWER: C50 C51 FB2 R47 U7
I2C PULLUPS: R51-R54
BOOT SW: SW4
NRST: C54 SW5
VDDA CAPS: C55 C56
ERROR/STATUS LEDS: D5-D7 R55-R57
VDD CAPS: C59-C65

### Ports
FCC_GPIO0 (bidir, see FCC_Connectors[1B]), FCC_GPIO1 (bidir, see FCC_Connectors[1B]), FCC_GPIO2 (bidir, see FCC_Connectors[1B]), FCC_GPIO3 (bidir, see FCC_Connectors[1B]), FCC_NRST (out, see FCC_Connectors[1A], FCC_MCU[3C]), FCC_NRST (out, see FCC_Connectors[1A], FCC_MCU[4A]), FCC_SCL1 (in, see FCC_Peripherals[1A]), FCC_SCL2 (out, see FCC_MCU[1B], FCC_Peripherals[2C]), FCC_SCL2 (out, see FCC_MCU[3C], FCC_Peripherals[2C]), FCC_SCL3 (out, see FCC_MCU[1A], FCC_Peripherals[2A]), FCC_SCL3 (out, see FCC_MCU[3C], FCC_Peripherals[2A]), FCC_SDA1 (in, see FCC_Peripherals[1B]), FCC_SDA2 (in, see FCC_MCU[3C], FCC_Peripherals[2C]), FCC_SDA2 (out, see FCC_MCU[1B], FCC_Peripherals[2C]), FCC_SDA3 (in, see FCC_MCU[3C], FCC_Peripherals[2A]), FCC_SDA3 (out, see FCC_MCU[2A], FCC_Peripherals[2A]), FCC_SWCLK (bidir, see FCC_Connectors[1A]), FCC_SWDIO (bidir, see FCC_Connectors[1A]), LSM6_INT1 (out, see FCC_Peripherals[2A]), LSM6_INT2 (out, see FCC_Peripherals[2A]), NAVC_FCC_MISO (bidir, see NAVC_MCU[1B]), NAVC_FCC_MOSI (bidir, see NAVC_MCU[1B]), NAVC_FCC_NSS (bidir, see NAVC_MCU[1B]), NAVC_FCC_SCK (bidir, see NAVC_MCU[1B])

### Nets
+3V3: C59.2(A) C60.1 C61.1 C62.1 C63.1 C64.1 C65.1 FB2.1 R47.1 R50.1 R51.2 R52.2 R53.2 R54.2 U7.6(VBAT) U7.11(VDD) U7.19(VDD) U7.28(VDD) U7.50(VDD) U7.75(VDD) U7.100(VDD)
+3V3A_F: C55.1 C56.2 FB2.2 U7.21(VREF+) U7.22(VDDA)
GND: C50.2 C51.2 C52.1 C53.1 C54.2 C55.2 C56.1 C57.1 C58.1 C59.1(C) C60.2 C61.2 C62.2 C63.2 C64.2 C65.2 D5.1(K) D6.1(K) D7.1(K) SW4.3 SW4.4 SW5.2 U7.10(VSS) U7.20(VSSA) U7.27(VSS) U7.74(VSS) U7.99(VSS) Y4.2(GND) Y4.4(GND)
FCC_BOOT0: R47.2 SW4.1 U7.94(BOOT0)
FCC_BOOT1: R50.2 SW4.2 U7.37(PB2)
FCC_LED_0: R55.1 U7.81(PD0)
FCC_LED_1: R56.1 U7.82(PD1)
FCC_LED_2: R57.1 U7.83(PD2)
FCC_OSC25_N: C58.2 U7.13(PH1) Y4.1
FCC_OSC25_P: C57.2 U7.12(PH0) Y4.3
FCC_OSC32_N: C52.2 U7.9(PC15) Y3.1
FCC_OSC32_P: C53.2 U7.8(PC14) Y3.2
PB0: R45.2 U7.35(PB0)
PB1: R45.1 U7.36(PB1)
PC4: R45.4 U7.33(PC4)
PC5: R45.3 U7.34(PC5)
NetC50_1: C50.1 U7.49(VCAP_1)
NetC51_1: C51.1 U7.73(VCAP_2)
NetC54_1: C54.1 SW5.1 U7.14(~{RST}) ; port FCC_NRST
NetD5_2: D5.2(A) R55.2
NetD6_2: D6.2(A) R56.2
NetD7_2: D7.2(A) R57.2
NetP9_2: U7.76(PA14) ; port FCC_SWCLK
NetP9_3: U7.72(PA13) ; port FCC_SWDIO
NetP12_2: R45.5 ; port FCC_GPIO0
NetP12_3: R45.6 ; port FCC_GPIO1
NetP12_4: R45.7 ; port FCC_GPIO2
NetP12_5: R45.8 ; port FCC_GPIO3
NetQ2_2: U7.92(PB6) ; port FCC_SCL1
NetQ3_2: U7.93(PB7) ; port FCC_SDA1
NetR46_1: R46.1 ; port NAVC_FCC_NSS
NetR46_2: R46.2 ; port NAVC_FCC_SCK
NetR46_3: R46.3 ; port NAVC_FCC_MISO
NetR46_4: R46.4 ; port NAVC_FCC_MOSI
NetR46_5: R46.5 U7.32(PA7)
NetR46_6: R46.6 U7.31(PA6)
NetR46_7: R46.7 U7.30(PA5)
NetR46_8: R46.8 U7.29(PA4)
NetR48_1: R48.1 ; port LSM6_INT1
NetR48_2: R48.2 U7.68(PA9)
NetR49_1: R49.1 ; port LSM6_INT2
NetR49_2: R49.2 U7.69(PA10)
NetR51_1: R51.1 U7.47(PB10) ; port FCC_SCL2
NetR52_1: R52.1 U7.48(PB11) ; port FCC_SDA2
NetR53_1: R53.1 U7.67(PA8) ; port FCC_SCL3
NetR54_1: R54.1 U7.66(PC9) ; port FCC_SDA3

Not connected (* = marked no-connect by the designer): U7 1(PE2) 2(PE3) 3(PE4) 4(PE5) 5(PE6) 7(PC13) 15(PC0) 16(PC1) 17(PC2) 18(PC3) 23(PA0) 24(PA1) 25(PA2) 26(PA3) 38(PE7) 39(PE8) 40(PE9) 41(PE10) 42(PE11) 43(PE12) 44(PE13) 45(PE14) 46(PE15) 51(PB12) 52(PB13) 53(PB14) 54(PB15) 55(PD8) 56(PD9) 57(PD10) 58(PD11) 59(PD12) 60(PD13) 61(PD14) 62(PD15) 63(PC6) 64(PC7) 65(PC8) 70(PA11) 71(PA12) 77(PA15) 78(PC10) 79(PC11) 80(PC12) 84(PD3) 85(PD4) 86(PD5) 87(PD6) 88(PD7) 89(PB3) 90(PB4) 91(PB5) 95(PB8) 96(PB9) 97(PE0) 98(PE1)

### Layout directives
differential pair: FCC_OSC25_N, FCC_OSC25_P, FCC_OSC32_N, FCC_OSC32_P

### Notes on the sheet
- (near C56) Close to pin 22
- Close to pin 11,19,28,50,
  75,100
- (in symbol CMP-1433-00002-2) ON
- (in symbol CMP-03017-000032-1) +

### Library data of the parts
C50 C51 C54 C55 C60-C65 = CMP-2000-07546-2: as C31 on sheet NAVC_Peripherals; Weight: 7.1E-05oz; Composition: Ceramic; Max Operating Temperature: 125°C; Termination: SMD/SMT; Dielectric: X7R; Length: 1.6mm; Package Quantity: 1; REACH SVHC: No SVHC; Lead Free: Lead Free; Case Code (Metric): 1608; Min Operating Temperature: -55°C; Packaging: Tape and Reel; Tolerance: 10%; Voltage Rating: 50V; Case Code (Imperial): 0603; Capacitance: 100nF; Case/Package: 0603; Voltage Rating (DC): 50V; Depth: 0.8mm; Radiation Hardening: No; Ratings: AEC-Q200; Mount: Surface Mount; Voltage: 50V; Thickness: 0.035inch; Width: 0.8mm; Height: 0.8mm
C52 C53 = CMP-2000-04945-1: Chip Capacitor, 22 pF, +/- 5%, 50 V, -55 to 125 degC, 0603 (1608 Metric), RoHS, Tape and Reel; Manufacturer: Murata; Rated Voltage: 50V; Dielectric: C0G; Capacitance: 22pF; Manufacturer URL: http://www.murata.com/; Datasheet Version: Jul-06; Package Reference: 603; Tolerance (%): ±5%; Case Size/Dimension: 0603; Package Description: 2-Pin Surface Mount Device, Body 1.6 x 0.8 mm; Datasheet URL: https://datasheet.ciiva.com/11786/0900766b807a1cab-11786398.pdf
C56 = CMP-2006-03713-1: Part Number: C0603C105K3RACTU; Manufacturer: Kemet
C57 C58 = CMP-2006-02592-1: Part Number: GRM1885C1H100JA01D; Manufacturer: Murata
C59 = CMP-03017-000032-1: as C29 on sheet NAVC_Peripherals; Lead Free: Lead Free; Features: General Purpose; Length: 3.2mm; Mount: Surface Mount; Number of Pins: 2; RoHS Compliant: Yes; Case/Package: 1206; Width: 1.6mm; Capacitance: 10uF; REACH SVHC: No SVHC; Voltage Rating (DC): 6.3V; Max Operating Temperature: 125°C; Height - Seated (Max): 0.071inch; Termination: SMD/SMT; Radiation Hardening: No; Tolerance: 10%; Min Operating Temperature: -55°C; Lead Pitch: 1.2mm; Voltage: 6.3V; Depth: 1.6mm; Case Code (Imperial): 1206; Case Code (Metric): 3216; Packaging: Tape and Reel; Height: 1.6mm; Voltage Rating: 6.3V; Package Quantity: 1
D5-D7 = CMP-1426-00017-3: as D4 on sheet NAVC_Peripherals; Case Code (Imperial): 1206; Length: 3.2mm; Mount: Surface Mount; Case Code (Metric): 3216; Case/Package: 1206; Min Operating Temperature: -40°C; Width: 1.6mm; Color: Red; Height: 680µm; REACH SVHC: Unknown; Max Operating Temperature: 85°C; Wavelength: 630nm; RoHS: Compliant; Packaging: Tape and Reel
FB2 = CMP-0220-00181-3: NexarPartId: 7864500; RMS Current (Irms): 1A; Number of Lines: 1; Test Frequency: 100MHz; Impedance: 600Ω; Inductance: 360mH; Resistance: 200mΩ; Tolerance: 25%; Case Code (Imperial): 0603; Lead Free: Lead Free; Current Rating: 1A; Height: 800µm; Min Operating Temperature: -55°C; Core Material: Ferrite; REACH SVHC: Unknown; Case/Package: 0603; Weight: 3.997283mg; Mount: Surface Mount; Termination: SMD/SMT; Case Code (Metric): 1608; DC Resistance (DCR): 200mΩ; Series Resistance: 200mΩ; Max Operating Temperature: 125°C; Width: 800µm; Length: 1.6mm; Max DC Current: 1A; RoHS: Compliant; Material: Ferrite; Max Current Rating: 1A; Depth: 800µm; Packaging: Cut Tape (CT)
R45 R46 = CMP-2000-06066-1: Chip Resistor Array, 22 Ohm, +/- 5%, -55 to 125 degC, 8-Pin SMD, RoHS, Tape and Reel; Manufacturer: Bourns; Resistance: 22Ohms; Temperature, Operating: -55to+125°C; Power, Rating: 0.125W; Number of Resistors: 4; Temperature, Coefficent: ±250; Brand/Series: CAT10Series; Circuit: IsolatedArray; Mounting Type: SurfaceMount; Tolerance: ±5%; Datasheet Version: 01/2015; Package Description: 8-Pin Surface Mount Device, Body 2 x 1 mm, Pitch 0.5 mm; Number of Terminals: 8; Dimensions: 0.44x0.039x0.022(2x1x0.55)LxWxHin.(mm); Package Reference: CAT10; Mounting Technology: SurfaceMount; Manufacturer URL: http://www.bourns.com/; Package Type: SMT; Datasheet URL: http://www.bourns.com/docs/Product-Datasheets/CAT10.pdf
R47-R54 = CMP-2100-03667-1: as R38 on sheet NAVC_Peripherals; Width: 0.8mm; Max Operating Temperature: 155degC; Tolerance: 5%; Package Reference: 0603; Height: 0.45mm; Depth: 0.8mm; Package Description: 2-Pin Surface Mount Device, Body 1.6 x 0.8 mm; Termination: SMD/SMT; Package Quantity: 5000; Case/Package: 0603; Case Code (Imperial): 0603; Radiation Hardening: No; Number of Pins: 2; Length: 1.6mm; Lead Free: LeadFree; Voltage Rating (DC): 50V; Military Standard: Not; Datasheet URL: http://www.yageo.com/NewPortal/yageodocoutput?fileName=/pdf/R-Chip/PYu-RC_Group_51_RoHS_L_5.pdf; Manufacturer URL: http://www.yageo.com/; Packaging: TapeandReel; Case Code (Metric): 1608; Min Operating Temperature: -55degC; Composition: ThickFilm; RoHSCompliant: true; Contact Plating: Tin; Datasheet Version: Rev. 5, 10/2016; REACH SVHC: NoSVHC
R55-R57 = CMP-2000-03816-5: as R31 on sheet NAVC_Peripherals; Package Quantity: 5000; DatasheetVersion: 06/2012; Min Operating Temperature: -55 degC; ComponentLink1URL: http://www.vishay.com/; Mounting Technology: Surface Mount; Height: 0.45 mm; ComponentLink1Description: Manufacturer URL; REACH SVHC: Unknown; PackageReference: 0603; Packaging: Tape and Reel; Max Operating Temperature: 155 degC; Mount: Surface Mount; ComponentLink2Description: Datasheet; PackageDescription: 2-Pin Surface Mount Device, Body 1.575 x 0.85 mm; Length: 1.55 mm; ComponentLink2URL: http://www.vishay.com/docs/20035/dcrcwe3.pdf; Pins: 2; RoHSCompliant: true
SW4 = CMP-1433-00002-2: NexarPartId: 19787098; Number of Circuits: 2; Throw Configuration: SPST; Voltage Rating (DC): 24V; Body Material: Polyphenylene; Mechanical Life: 2kcycles; Insulation Resistance: 100MΩ; Current Rating: 25mA; Electrical Life: 1kcycles; Washable: Yes; Contact Resistance: 50mΩ; Pitch: 1.27mm; Max Operating Temperature: 85°C; Number of Pins: 2; Contact Material: Gold; Width: 5.6mm; Color: Black; RoHS: Compliant; Min Operating Temperature: -40°C; Termination: Gull Wing; Packaging: Tape and Reel; Lead Free: Lead Free; Voltage Rating: 24V; Number of Positions: 2; REACH SVHC: No SVHC; Height: 2mm; Contact Current Rating: 25mA; Length: 3.71mm; Contact Plating: Gold; Max Voltage Rating (DC): 24V; Mount: Surface Mount
SW5 = CMP-1459-00005-3: as SW3 on sheet NAVC_Peripherals; Packaging: Tape and Reel; Width: 6mm; Voltage Rating: 12V; Min Operating Temperature: -40°C; RoHS: Compliant; Height: 4.3mm; Insulation Resistance: 100MΩ; Contact Plating: Silver; Contact Current Rating: 50mA; Max Operating Temperature: 85°C
U7 = CMP-0243-00017-5: NexarPartId: 20570110; Manufacturer Package Identifier: 1L_ME_V5; Peripherals: Brown-out Detect/Reset, DMA, I2C, LCD, POR, PWM, WDT; Number of Programmable I/O: 82; Oscillator Type: Internal; Nominal Supply Current: 1.7µA; Number of Timers/Counters: 14; RAM Size: 192kB; Number of D/A Converters: 2; Number of Ethernet Channels: 1; Max Frequency: 168MHz; Number of SPI Channels: 3; Data Bus Width: 32b; Number of ADC Channels: 16; Max Supply Voltage: 3.6V; Number of USART Channels: 4; Interface: CAN, Ethernet, I2C, I2S, IrDA, LIN, SPI, UART, USART, USB; Max Junction Temperature (Tj): 125°C; Core Architecture: ARM Cortex-M4; Watchdog Timer: Yes; Memory Size: 1MB; Memory Type: FLASH; Min Supply Voltage: 1.8V; Number of I/Os: 82; Lead Free: Lead Free; Lifecycle Status: Production; Radiation Hardening: No; Frequency: 168MHz; Max Operating Temperature: 85°C; Height: 1.45mm; Number of Pins: 100; Number of I2C Channels: 3; Number of USB Channels: 1; REACH SVHC: No SVHC; Length: 14.2mm; Ambient Temperature Range High: 85°C; Schedule B: 8542310000, 8542310000; Number of Channels: 16; Number of A/D Converters: 3; Width: 14.2mm; Case/Package: LQFP; Flash Memory Size: 1MB; Min Operating Temperature: -40°C; Address Bus Width: 32b; Number of UART Channels: 2; RoHS: Compliant; Number of PWM Channels: 2
Y3 = CMP-27762-008890-2: Crystal 32.768kHz ±20ppm (Tol) 12.5pF FUND 90kΩ 2-Pin SMD T/R; Series Resistance: 90kR; Length: 1.6mm; Package Quantity: 3000; Packaging: Tape and Reel; Max Operating Temperature: 85°C; Lead Free: Lead Free; Tolerance: 20ppm; Frequency: 32.768kHz; Termination: SMD/SMT; REACH SVHC: No SVHC; Width: 1mm; Min Operating Temperature: -40°C; RoHS Compliant: Yes; Case/Package: CSMD; ESR (Equivalent Series Resistance): 90kR; Number of Pins: 2; Height: 0.5mm; Series: ABS05; Load Capacitance: 12.5pF; Frequency Tolerance: 20ppm; Depth: 1mm; Operating Frequency: 32.768 kHz; Mount: Surface Mount; Radiation Hardening: No
Y4 = CMP-27762-010178-1: Crystal 25MHz ±10ppm 10pF SMD-4 3.2mm x 2.5mm; Frequency Stability: 15ppm; ESR (Equivalent Series Resistance): 50R; Mount: Surface Mount; Load Capacitance: 10pF; Frequency Tolerance: 10ppm; Max Operating Temperature: 85°C; Frequency: 25MHz; Case/Package: SMD/SMT; Length: 0.126inch; RoHS Compliant: Yes; Min Operating Temperature: -40°C; Width: 0.098inch; Height: 0.031inch; Packaging: Tape and Reel

## Sheet Power.SchDoc
size A4; SheetNumber: 8; SheetTotal: 8
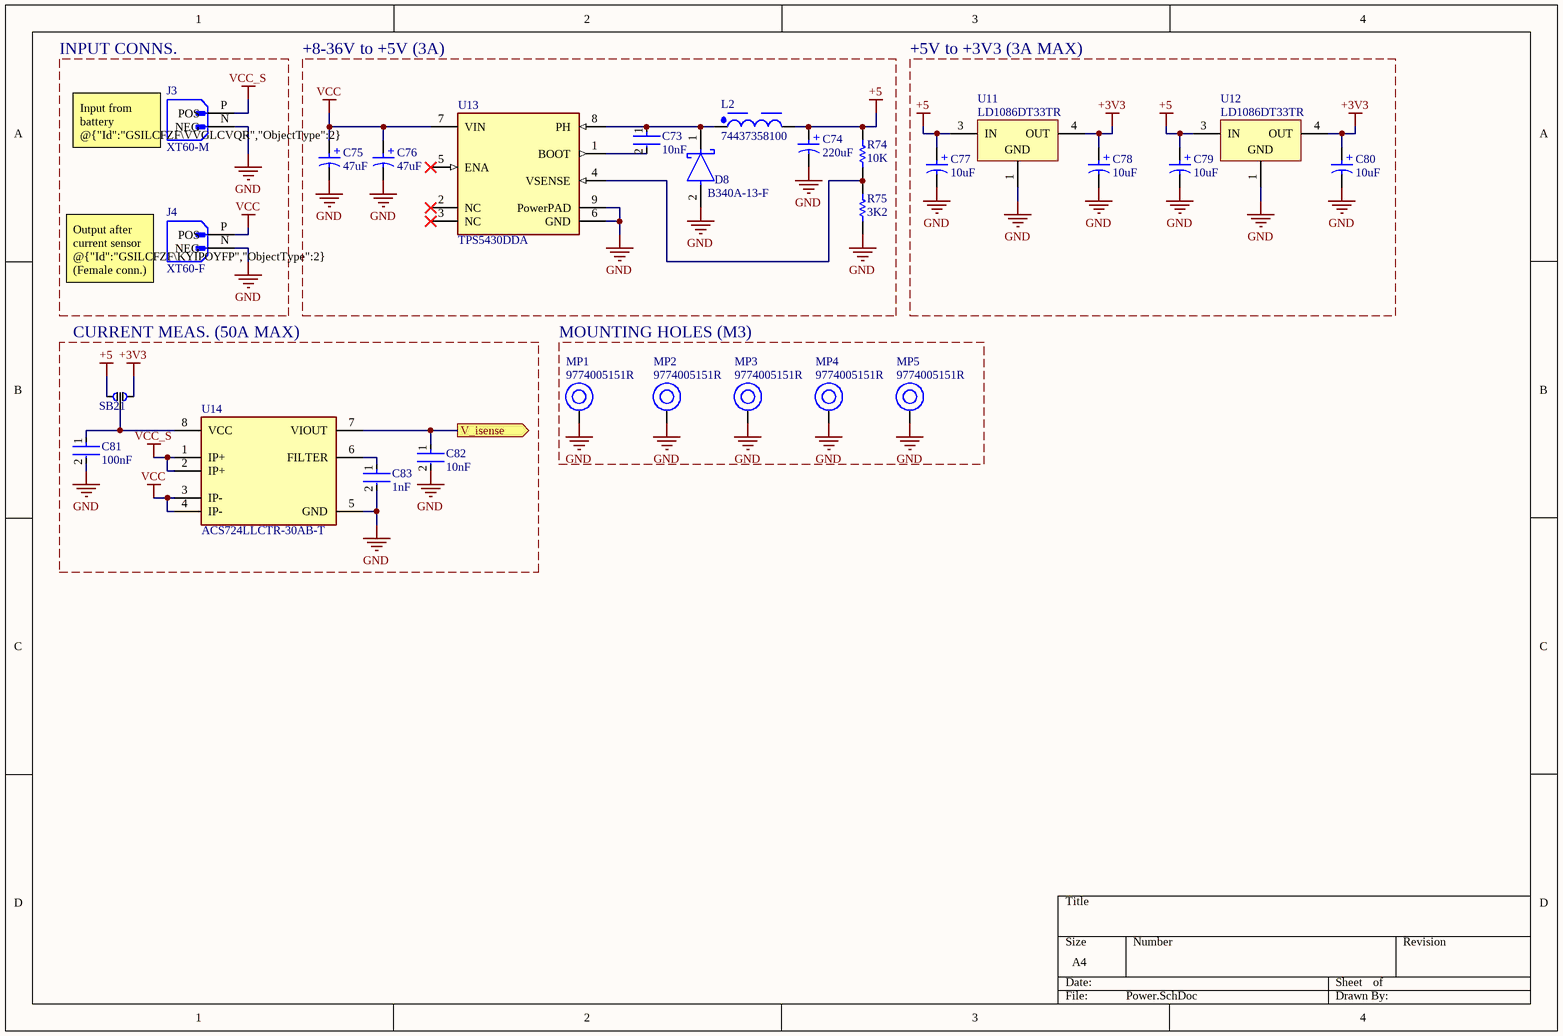
[diagram p7: Power.SchDoc]

### Parts
C73  10nF  [FP-GRM188-0_1-e0_2_0_55-IPC_A]
C74  220uF  [WCAP-ASLI_D8H10.5]
C75  47uF  [WCAP-PSLP_D6.3H7.7]
C76  47uF  [WCAP-PSLP_D6.3H7.7]
C77  10uF  [WCAP-ASLL_D6.3H5.5]
C78  10uF  [WCAP-ASLL_D6.3H5.5]
C79  10uF  [WCAP-ASLL_D6.3H5.5]
C80  10uF  [WCAP-ASLL_D6.3H5.5]
C81  100nF  [FP-GRM188-0_1-e0_2_0_55-IPC_A]
C82  10nF  [FP-GRM188-0_1-e0_2_0_55-IPC_A]
C83  1nF  [FP-GRM188-0_1-e0_2_0_55-IPC_A]
D8  B340A-13-F  [FP-SMA-MFG]
J3  XT60-M  [AMASS_XT60-M]
J4  XT60-F  [AMASS_XT60-M]
L2  74437358100  [WE-LHMI_8040]
MP1  9774005151R  [9774005151]
MP2  9774005151R  [9774005151]
MP3  9774005151R  [9774005151]
MP4  9774005151R  [9774005151]
MP5  9774005151R  [9774005151]
R74  10K  [RESC1608X90X30ML15T20]
R75  3K2  [RESC1608X90X30ML15T20]
SB21  Solderbridge3P  [SolderBridge3P]  (value not drawn)
U11  LD1086DT33TR  [TO-252_L]
U12  LD1086DT33TR  [TO-252_L]
U13  TPS5430DDA  [FP-DDA0008J-MFG]
U14  ACS724LLCTR-30AB-T  [FP-LCN-8-IPC_A]

### Blocks framed on the sheet
INPUT CONNS.: J3 J4
+8-36V to +5V (3A): C73-C76 D8 L2 R74 R75 U13
+5V to +3V3 (3A MAX): C77-C80 U11 U12
CURRENT MEAS. (50A MAX): C81-C83 SB21 U14
MOUNTING HOLES (M3): MP1-MP5

### Ports
V_isense (out, see NAVC_MCU[1A])

### Nets
+3V3: C78.1(P) C80.1(P) SB21.2 U11.4(OUT) U12.4(OUT)
+5: C74.1(P) C77.1(P) C79.1(P) L2.2 R74.2 SB21.1 U11.3(IN) U12.3(IN)
GND: C74.2(N) C75.2(N) C76.2(N) C77.2(N) C78.2(N) C79.2(N) C80.2(N) C81.2 C82.2 C83.2 D8.2(A) J3.N(NEG) J4.N(NEG) MP1.1 MP2.1 MP3.1 MP4.1 MP5.1 R75.1 U11.1(GND) U12.1(GND) U13.6(GND) U13.9(PowerPAD) U14.5(GND)
VCC: C75.1(P) C76.1(P) J4.P(POS) U13.7(VIN) U14.3(IP-) U14.4(IP-)
VCC_S: J3.P(POS) U14.1(IP+) U14.2(IP+)
NetC73_1: C73.1 D8.1(C) L2.1 U13.8(PH)
NetC73_2: C73.2 U13.1(BOOT)
NetC81_1: C81.1 SB21.3 U14.8(VCC)
NetC82_1: C82.1 U14.7(VIOUT) ; port V_isense
NetC83_1: C83.1 U14.6(FILTER)
NetR74_1: R74.1 R75.2 U13.4(VSENSE)

Not connected (* = marked no-connect by the designer): U13 2(NC)* 3(NC)* 5(ENA)*

### Notes on the sheet
- (near J3) Input from battery @{"Id":"GSILCFZF\VVGLCVQR","ObjectType":2}
  (Male conn.)
- Output after current sensor @{"Id":"GSILCFZF\KYIPOYFP","ObjectType":2}
  (Female conn.)
- (in symbol CMP-03913-53914528-2) +
- (in symbol CMP-03913-54202498-1) +
- (in symbol CMP-03913-89977562-1) +

### Library data of the parts
C73 C81-C83 = CMP-2006-02792-2: Chip Multilayer Ceramic Capacitors for General Purpose, 0603, 10uF, X5R, 15%, 20%, 6.3V; Packaging: Tape and Reel; Voltage Rating (DC): 6.3V; Width: 0.031inch; Termination: SMD/SMT; Dielectric: X5R; Package Quantity: 4000; Voltage Rating: 6.3V; Capacitance: 10uF; Case/Package: 0603; Min Operating Temperature: -55°C; Voltage: 6.3V; Length: 1.6mm; Thickness: 0.035inch; Lead Free: Lead Free; Depth: 0.8mm; Case Code (Imperial): 0603; Max Operating Temperature: 85°C; Material: Ceramic; Height: 0.8mm; Tolerance: 20%; Mount: Surface Mount; REACH SVHC: No SVHC; Radiation Hardening: No; Case Code (Metric): 1608
C74 = CMP-03913-54202498-1: 865080553014 Alum. Electrolytic Cap 220µF 35V 8mmV-Chip WCAP-ASLI; Lifetime 2000h +105°C; Life (Hours): 2000hours; Impedance: 210mΩ; Ripple Current: 570mA; Tolerance: 20%; Polarity: Polar; ESR (Equivalent Series Resistance): 131.909mΩ; Insulation Resistance: 454.545kΩ; Leakage Current: 77µA; Height - Seated (Max): 10.4902mm; Capacitance: 220µF; Mount: Surface Mount; Voltage Rating (DC): 35V; Case/Package: Radial; Width: 8.3mm; NexarPartId: 54202498; Ripple Current (AC): 570mA; REACH SVHC: Unknown; Min Operating Temperature: -55°C; Diameter: 8mm; Max Operating Temperature: 105°C; RoHS: Compliant; Packaging: Tape & Reel (TR); Height: 10.5mm; Length: 10.5mm; Voltage Rating: 35V
C75 C76 = CMP-03913-89977562-1: 875105645005 Cap, 47Uf, 35V, Alu Elec Smd, Polymer Rohs Compliant: Yes; Ripple Current: 1.6A; Leakage Current: 600µA; ESR (Equivalent Series Resistance): 50mΩ; Capacitance: 47µF; Length: 7.7mm; Diameter: 6.3mm; NexarPartId: 89977562; Voltage Rating: 35V; Width: 6.6mm
C77-C80 = CMP-03913-53914528-2: 865060643005 WCAP-ASLL Aluminum Electrolytic Capacitors; Polarity: Polar; Insulation Resistance: 10MΩ; Ripple Current (AC): 165mA; Tolerance: 20%; Leakage Current: 5µA; ESR (Equivalent Series Resistance): 1.13596Ω; Capacitance: 10µF; Life (Hours): 2000hours; Impedance: 1.4Ω; Voltage Rating: 50V; Max Operating Temperature: 105°C; Diameter: 6.3mm; Case/Package: Radial; Length: 5.5mm; NexarPartId: 53914528; REACH SVHC: Unknown; Min Operating Temperature: -55°C; RoHS: Compliant; Ripple Current: 165mA; Mount: Surface Mount; Height - Seated (Max): 5.5118mm; Height: 5.5mm; Voltage Rating (DC): 50V
D8 = CMP-1667-00003-3: DIODE SCHOTTKY 40V 3A SMA; Max Forward Surge Current (Ifsm): 80A; Forward Voltage: 500mV; Polarity: Standard; Max Reverse Current: 500uA; Capacitance: 250pF; Element Configuration: Single; Mount: Surface Mount; Output Current: 3A; Radiation Hardening: No; Width: 2.92mm; Current Rating: 3A; Termination: SMD/SMT; Voltage: 40V; Series: -; Max Operating Temperature: 125°C; Current: 3A; Max Repetitive Reverse Voltage (Vrrm): 40V; Min Operating Temperature: -55°C; REACH SVHC: No SVHC; Number of Pins: 2; Average Rectified Current: 3A; Contact Plating: Tin; RoHS Compliant: Yes; Max Reverse Voltage (DC): 40V; Packaging: Tape and Reel; Height: 2.3mm; Length: 4.6mm; Case/Package: SMA; Weight: 0.002258oz; Peak Non-Repetitive Surge Current: 80A; Package Quantity: 5000; Lead Free: Lead Free; Forward Current: 3A; Voltage Rating (DC): 40V
J3 J4 = XT60-M: Plug; DC supply; XT60; male; PIN: 2; for cable; soldered; 30A; 500V; MF: AMASS; SnapEDA_Link: https://www.snapeda.com/parts/XT60-M/AMASS/view-part/?ref=snap; Package: Package; Value: *; MP: XT60-M; Check_prices: https://www.snapeda.com/parts/XT60-M/AMASS/view-part/?ref=eda
  J3: Component Type: Source
L2 = CMP-03913-61645318-4: 74437358100 Power Inductor, 10Uh, Shielded, 4.5A Rohs Compliant: Yes; Test Frequency: 100kHz; Core Material: Ferrite; DC Resistance (DCR): 48.1mΩ; Tolerance: 20%; Self Resonant Frequency: 9MHz; Saturation Current: 8.3A; Inductance: 10µH; Ambient Temperature Range High: 85°C; Width: 8.5mm; Min Operating Temperature: -40°C; Height: 4mm; Packaging: Tape & Reel (TR); Ambient Temperature Range Low: -40°C; Mount: Surface Mount; Shielding: Shielded; Max Operating Temperature: 125°C; Height - Seated (Max): 3.9878mm; NexarPartId: 61645318; Current Rating: 4.5A; Case/Package: Nonstandard; RoHS: Compliant; Composition: Wirewound; Length: 9.7mm
MP1-MP5 = CMP-03913-118042550-1: 9774005151R WA-SMSI SMT Steel Spacer, M2.5 Internal non Stop; Material: Steel; Max Operating Temperature: 150°C; RoHS: Compliant; Packaging: Tape and Reel; Min Operating Temperature: -55°C; Length: 500µm; NexarPartId: 118042550
R74 R75 = CMP-2000-00869-1: Part Number: ERT-J1VR103J; Manufacturer: Panasonic
U11 U12 = CMP-0244-00125-1: 1.5A, Low Drop Positive Voltage Regulator, 3.3V, 3-Pin DPAK, Tape and Reel; ComponentLink2URL: http://www.st.com/internet/com/TECHNICAL_RESOURCES/TECHNICAL_LITERATURE/DATASHEET/CD00001884.pdf; ComponentLink1URL: http://www.st.com; PackageReference: TO-252; ComponentLink1Description: Manufacturer URL; ComponentLink2Description: Datasheet; PackageVersion: 2011; PackageDescription: 3-Pin Transistor Outline Package 2.28 mm Pitch, 9.7 mm Lead Span (DPAK); DatasheetVersion: 11/07/2011; Component Type: VRM
U13 = CMP-2000-04960-2: IC REG BUCK ADJUSTABLE 3A 8SOPWR; Manufacturer: Texas Instruments; Max Junction Temp: +125°C; Max Supply Voltage: 36V; Switching Frequency: 500kHz; Output Type: AdjustableProgrammable; Standoff Height: 0mm; Output Voltage: 1.23-31V; Max Duty Cycle: 89%; Nominal Supply Current: 3mA; Min Supply Voltage: 5.5V; Number Of Outputs: 1; Temperature: -40°C to +125°C; Temperature Range High: +125°C; Manufacturer Part Number: TPS5430DDA; Device Class L3: Voltage Regulators - Switching; Mouser Description: Voltage Regulators - Switching Regulators 5.5 to 36V Input 3A Step Dwn Converter; Switching Topology: Buck; ComponentLink2URL: http://www.ti.com/lit/ds/symlink/tps5431.pdf; ComponentLink2Description: Datasheet; Device Class L2: Power Management ICs; Device Class L1: Integrated Circuits (ICs); Digikey Description: IC REG BUCK ADJUSTABLE 3A 8SOPWR; RoHS: TRUE; Octopart: https://octopart.com/tps5430dda-texas+instruments-589977; Output Current: 3A; Automotive: No; Lead Free: Yes; Category: IC; Package: DDA0008J; Temperature Range Low: -40°C; Height: 1.7mm; Component Type: VRM
U14 = CMP-82923-000166-2: SENSOR CURRENT HALL 30A AC/DC; Number of Channels: 1; Response Time: 4us; Polarity: Bidirectional; Frequency: 120kHz; Max Supply Current: 14mA; Accuracy: 0.8%; Linearity: 1.5%; Sensitivity: 66mV/A; Min Operating Temperature: -40°C; Case/Package: SOIC; Current Sensing: 30A; Packaging: Tape and Reel; Number of Pins: 8; Mount: Surface Mount; Max Operating Temperature: 150°C; RoHS Compliant: Yes